# Altium schematic sheet 3V3 LDO Regulator (Sleeping).SchDoc: 3V3 LDO Voltage Regulator (Sleeping)
size A4; SheetNumber: 13; SheetTotal: 37
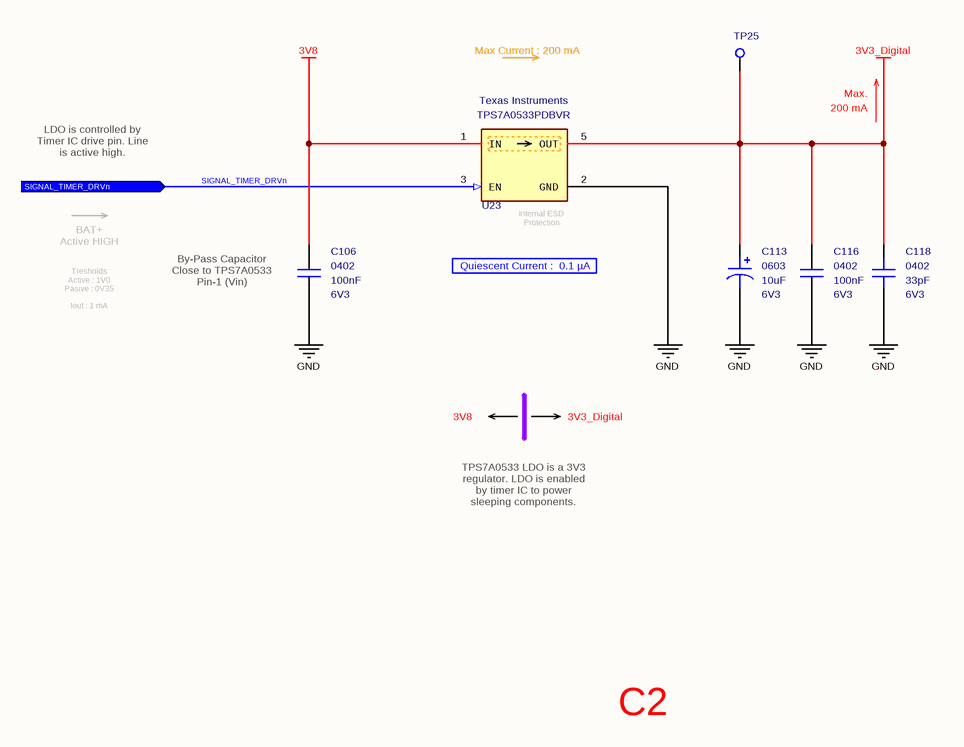
[diagram p0: 3V3 LDO Regulator (Sleeping).SchDoc]

## Parts
C106  value 100nF  Case: 0402  Voltage: 6V3  [CAPACITOR_0402]  (hidden comment: Multilayer Ceramic Capacitor)
C113  value 10uF  Case: 0603  Voltage: 6V3  [CAPACITOR_0603 - TANTALUM]  (hidden comment: Tantalum Capacitor)
C116  value 100nF  Case: 0402  Voltage: 6V3  [CAPACITOR_0402]  (hidden comment: Multilayer Ceramic Capacitor)
C118  value 33pF  Case: 0402  Voltage: 6V3  [CAPACITOR_0402]  (hidden comment: Multilayer Ceramic Capacitor)
TP25  PCB - Test Point  [Test_Pad - Hole]  (value not drawn)  (no BOM)
U23  Manufacturer_Part_Number: TPS7A0533PDBVR  Manufacturer_Name: Texas Instruments  [SOT-23-5]  (hidden comment: LDO Voltage Regulator)

## Ports
SIGNAL_TIMER_DRVn (in)

## Nets
3V3_Digital: C113.1 C116.2 C118.1 TP25.1 U23.5(OUT)
3V8: C106.1 U23.1(IN)
GND: C106.2 C113.2 C116.1 C118.2 U23.2(GND)
SIGNAL_TIMER_DRVn: U23.3(EN) ; port SIGNAL_TIMER_DRVn

## Notes on the sheet
- Max Current : 200 mA
- Max.
- LDO is controlled by Timer IC drive pin. Line is active high.
- 200 mA
- (near U23) Internal ESD Protection
- BAT+
  Active HIGH
- (near C106) By-Pass Capacitor
  Close to TPS7A0533
  Pin-1 (Vin)
- Quiescent Current :  0.1 µA
- Tresholds
  Active : 1V0
  Pasive : 0V35
  Iout : 1 mA
- 3V8
- 3V3_Digital
- TPS7A0533 LDO is a 3V3 regulator. LDO is enabled by timer IC to power sleeping components.
- C2
- Title
- Size:
- Date:
- A4
- Number:
- Time:
- Revision:
- Sheet
- of
- File:

## Library data of the parts
C106 C116 = Capacitor - 100nF [0402-6V3]: Capacitor - 100nF [0402-6V3] (Ceramic); Manufacturer_Name: AVX; Manufacturer_Part_Number: 04026D104KAT4A; Dielectric: X5R; Tolerance: %10; Height: 0.25mm; Mouser_Part_Number: 581-04026D104KAT4A; ComponentLink1Description: Mouser; ComponentLink1URL: https://www.mouser.com.tr/ProductDetail/AVX/04026D104KAT4A?qs=sGAEpiMZZMs0AnBnWHyRQPg4iYkCw7IMED%2F4kpqgf7w%3D; ComponentLink2Description: DataSheet; ComponentLink2URL: https://www.mouser.com.tr/datasheet/2/40/cx5r-776519.pdf; ROHS: Yes; Maximum Operating Temperature: +85; Minimum Operating Temperature: -55; Supplier 1: Avnet; Supplier Part Number 1: 04026D104KAT4A
C113 = Capacitor - 10uF [0603-6V3] (Tantalium): Capacitor - 10uF [0603] (Tantalium); Manufacturer_Name: AVX; Manufacturer_Part_Number: F380J106MMAAH3; ESR: 200 mOhms; Leakage Current: 10uA; Tolerance: 20%; Height: 0.8mm; Mouser_Part_Number: 581-F380J106MMAAH3; Maximum Operating Temperature: +105; Minimum Operating Temperature: -55; ROHS: Yes; ComponentLink1Description: DataSheet; ComponentLink1URL: https://www.mouser.com.tr/datasheet/2/40/f38-775706.pdf; ComponentLink2Description: Mouser; ComponentLink2URL: https://www.mouser.com.tr/ProductDetail/AVX/F380J106MMAAH3?qs=sGAEpiMZZMtZ1n0r9vR22fixilZl6Mr8zRKleESmvcDFwZ4LSyC6Pg%3D%3D; Supplier 1: Mouser; Supplier 2: Digi-Key; Supplier Part Number 2: 478-12031-1-ND; Supplier Part Number 1: 581-F380J106MMAAH3
C118 = Capacitor - 33pF [0402-6V3]: Capacitor - 33pF [0402] (Ceramic); Manufacturer_Name: Kemet; Manufacturer_Part_Number: C0402C330J9RACAUTO; Dielectric: X7R; Tolerance: 10%; Height: 0.5mm; Mouser_Part_Number: 80-C0402C330J9RAUTO; Maximum Operating Temperature: +125; Minimum Operating Temperature: -55; ROHS: Yes; ComponentLink1Description: DataSheet; ComponentLink1URL: https://api.kemet.com/component-edge/download/datasheet/C0402C330J9RACAUTO.pdf; ComponentLink2Description: Mouser; ComponentLink2URL: https://www.mouser.com/Search/Refine.aspx?Keyword=80-C0402C330J9RAUTO; Supplier 1: Mouser; Supplier Part Number 1: 80-C0402C330J9RAUTO
TP25 = PCB - Test Point: Test Point
U23 = IC - TPS7A0533PDBVR: LDO Voltage Regulators Cap-Free NMOS 200mA; Output Voltage: 3V3; Dropout Voltage - Max: 235 mV at 200 mA; Mouser_Part_Number: 595-TPS7A0533PDBVR; ComponentLink1Description: DataSheet; ComponentLink1URL: http://www.ti.com/general/docs/suppproductinfo.tsp?distId=26&gotoUrl=http%3A%2F%2Fwww.ti.com%2Flit%2Fgpn%2Ftps731; ComponentLink2Description: Mouser; ComponentLink2URL: https://eu.mouser.com/ProductDetail/Texas-Instruments/TPS73150DBVR?qs=6zVL%252ByCp0mpoSoYHNmngNA%3D%3D; Minimum Operating Temperature: -40; Output Current: 200 mA; Maximum Operating Temperature: +125; Supplier 1: Mouser; Supplier 2: Digi-Key; Case: SOT-23-5; Supplier Part Number 1: 595-TPS7A0533PDBVR; Supplier Part Number 2: 296-TPS7A0533PDBVRCT-ND